# Altium schematic sheet REVISION HISTORY.SchDoc
size A3; SheetNumber: 1; SheetTotal: 5
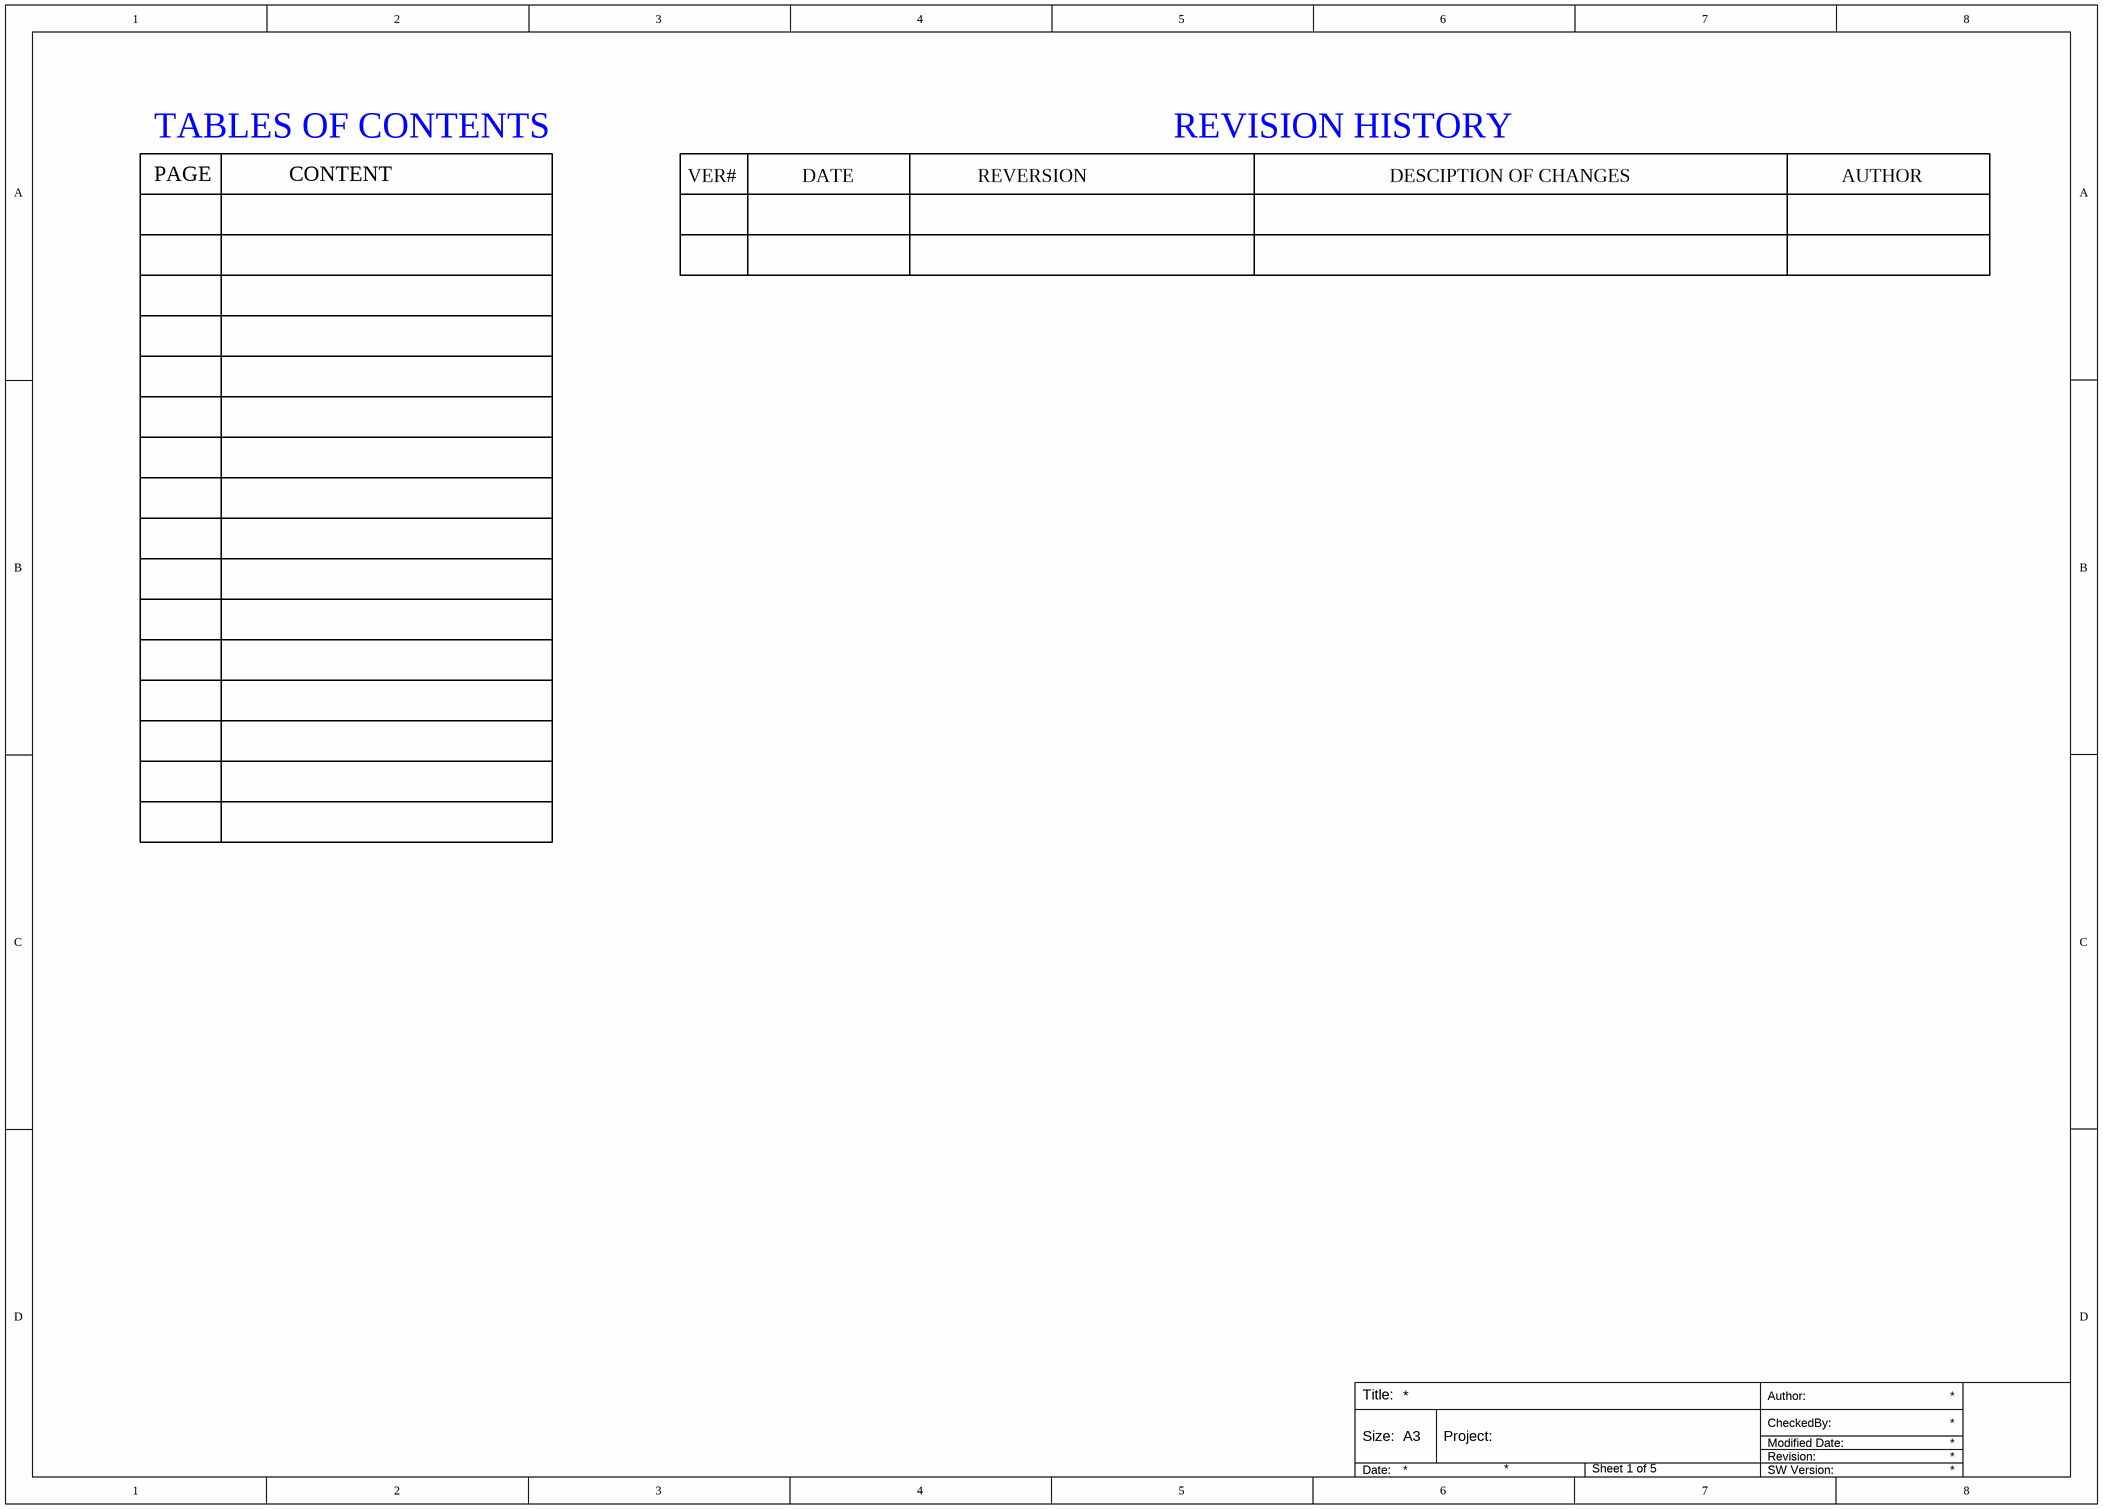
[diagram p0: REVISION HISTORY.SchDoc]

## Notes on the sheet
- TABLES OF CONTENTS
- PAGE
- CONTENT
- VER#
- DATE
- REVERSION
- REVISION HISTORY
- DESCIPTION OF CHANGES
- AUTHOR
- Author:
- Title:
- Size:
- A3
- Project:
- Revision:
- Modified Date:
- CheckedBy:
- Date:
- SW Version: